# EAGLE design TheLittleEngineers_org-CC3-SpeedBump-V1R1-03-30-1987 (EAGLE 5.10)

## Sheet 1 of 3
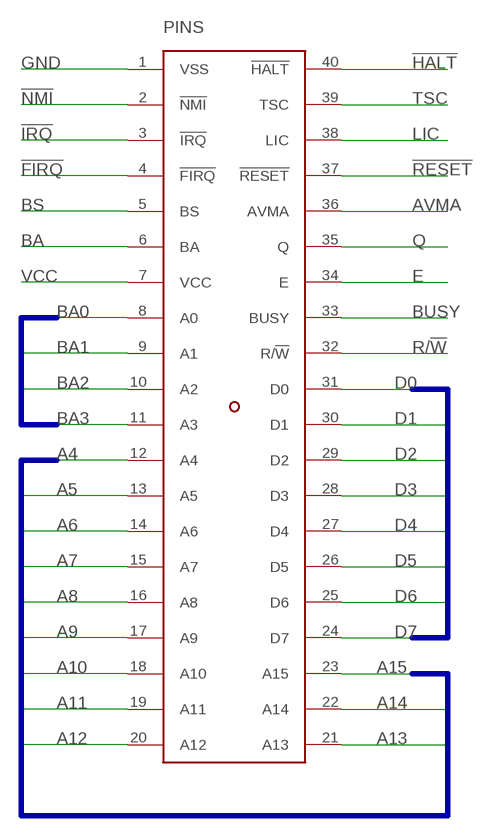
[diagram p0: schematic, sheet 1]

### Parts
PINS  6809E-ISOLATED-VCC-GND-NT-MSPL20  [DIL40-6-MACHINED-SOCKET-PINS-LAYER20OUTLINE]

### Nets
!FIRQ: PINS.4(!FIRQ) ; also sheet 2
!HALT: PINS.40(!HALT) ; also sheet 2
!IRQ: PINS.3(!IRQ) ; also sheet 2
!NMI: PINS.2(!NMI) ; also sheet 2
!RESET: PINS.37(!RESET) ; also sheet 2
A4: PINS.12(A4) ; also sheet 2,3
A5: PINS.13(A5) ; also sheet 2,3
A6: PINS.14(A6) ; also sheet 2,3
A7: PINS.15(A7) ; also sheet 2,3
A8: PINS.16(A8) ; also sheet 2,3
A9: PINS.17(A9) ; also sheet 2,3
A10: PINS.18(A10) ; also sheet 2,3
A11: PINS.19(A11) ; also sheet 2,3
A12: PINS.20(A12) ; also sheet 2,3
A13: PINS.21(A13) ; also sheet 2,3
A14: PINS.22(A14) ; also sheet 2,3
A15: PINS.23(A15) ; also sheet 2,3
AVMA: PINS.36(AVMA) ; also sheet 2
BA: PINS.6(BA) ; also sheet 2
BA0: PINS.8(A0) ; also sheet 3
BA1: PINS.9(A1) ; also sheet 3
BA2: PINS.10(A2) ; also sheet 3
BA3: PINS.11(A3) ; also sheet 3
BS: PINS.5(BS) ; also sheet 2
BUSY: PINS.33(BUSY) ; also sheet 2
D0: PINS.31(D0) ; also sheet 2
D1: PINS.30(D1) ; also sheet 2
D2: PINS.29(D2) ; also sheet 2
D3: PINS.28(D3) ; also sheet 2
D4: PINS.27(D4) ; also sheet 2
D5: PINS.26(D5) ; also sheet 2
D6: PINS.25(D6) ; also sheet 2
D7: PINS.24(D7) ; also sheet 2
E: PINS.34(E) ; also sheet 2
GND [power]: PINS.1(VSS) ; also sheet 2,3
LIC: PINS.38(LIC) ; also sheet 2
Q: PINS.35(Q) ; also sheet 2
R/!W: PINS.32(R/!W) ; also sheet 2
TSC: PINS.39(TSC) ; also sheet 2
VCC [power]: PINS.7(VCC) ; also sheet 2,3

### Buses
A[0..15]
BA[0..3]
D[0..7]

## Sheet 2 of 3
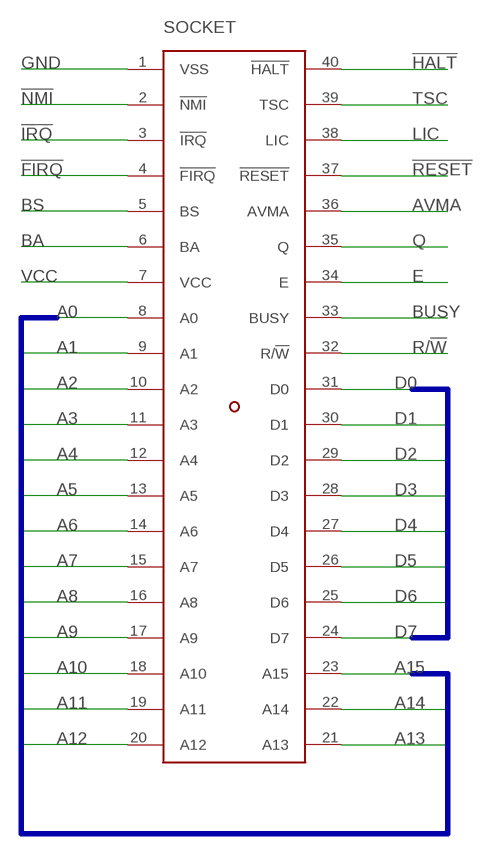
[diagram p1: schematic, sheet 2]

### Parts
SOCKET  6809E-ISOLATED-VCC-GND-NT-RHPS1  [DIL40-6-ROUND-HEADER-PINS-STAGGERED-1]

### Nets
!FIRQ: SOCKET.4(!FIRQ) ; also sheet 1
!HALT: SOCKET.40(!HALT) ; also sheet 1
!IRQ: SOCKET.3(!IRQ) ; also sheet 1
!NMI: SOCKET.2(!NMI) ; also sheet 1
!RESET: SOCKET.37(!RESET) ; also sheet 1
A0: SOCKET.8(A0) ; also sheet 3
A1: SOCKET.9(A1) ; also sheet 3
A2: SOCKET.10(A2) ; also sheet 3
A3: SOCKET.11(A3) ; also sheet 3
A4: SOCKET.12(A4) ; also sheet 1,3
A5: SOCKET.13(A5) ; also sheet 1,3
A6: SOCKET.14(A6) ; also sheet 1,3
A7: SOCKET.15(A7) ; also sheet 1,3
A8: SOCKET.16(A8) ; also sheet 1,3
A9: SOCKET.17(A9) ; also sheet 1,3
A10: SOCKET.18(A10) ; also sheet 1,3
A11: SOCKET.19(A11) ; also sheet 1,3
A12: SOCKET.20(A12) ; also sheet 1,3
A13: SOCKET.21(A13) ; also sheet 1,3
A14: SOCKET.22(A14) ; also sheet 1,3
A15: SOCKET.23(A15) ; also sheet 1,3
AVMA: SOCKET.36(AVMA) ; also sheet 1
BA: SOCKET.6(BA) ; also sheet 1
BS: SOCKET.5(BS) ; also sheet 1
BUSY: SOCKET.33(BUSY) ; also sheet 1
D0: SOCKET.31(D0) ; also sheet 1
D1: SOCKET.30(D1) ; also sheet 1
D2: SOCKET.29(D2) ; also sheet 1
D3: SOCKET.28(D3) ; also sheet 1
D4: SOCKET.27(D4) ; also sheet 1
D5: SOCKET.26(D5) ; also sheet 1
D6: SOCKET.25(D6) ; also sheet 1
D7: SOCKET.24(D7) ; also sheet 1
E: SOCKET.34(E) ; also sheet 1
GND [power]: SOCKET.1(VSS) ; also sheet 1,3
LIC: SOCKET.38(LIC) ; also sheet 1
Q: SOCKET.35(Q) ; also sheet 1
R/!W: SOCKET.32(R/!W) ; also sheet 1
TSC: SOCKET.39(TSC) ; also sheet 1
VCC [power]: SOCKET.7(VCC) ; also sheet 1,3

### Buses
A[0..15]
D[0..7]

## Sheet 3 of 3
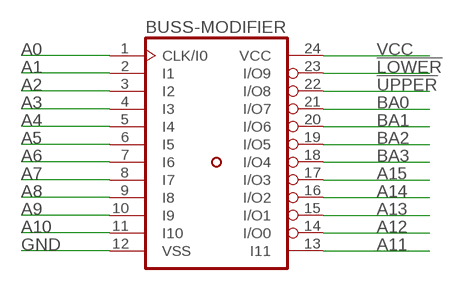
[diagram p2: schematic, sheet 3]

### Parts
BUSS-MODIFIER  GAL22V10N-TMO1S  [DIL24-3-TOP-MINIMAL-OUTLINE-1-STAGGERED]

### Nets
!LOWER: BUSS-MODIFIER.23(I/O9)
!UPPER: BUSS-MODIFIER.22(I/O8)
A0: BUSS-MODIFIER.1(CLK/I0) ; also sheet 2
A1: BUSS-MODIFIER.2(I1) ; also sheet 2
A2: BUSS-MODIFIER.3(I2) ; also sheet 2
A3: BUSS-MODIFIER.4(I3) ; also sheet 2
A4: BUSS-MODIFIER.5(I4) ; also sheet 1,2
A5: BUSS-MODIFIER.6(I5) ; also sheet 1,2
A6: BUSS-MODIFIER.7(I6) ; also sheet 1,2
A7: BUSS-MODIFIER.8(I7) ; also sheet 1,2
A8: BUSS-MODIFIER.9(I8) ; also sheet 1,2
A9: BUSS-MODIFIER.10(I9) ; also sheet 1,2
A10: BUSS-MODIFIER.11(I10) ; also sheet 1,2
A11: BUSS-MODIFIER.13(I11) ; also sheet 1,2
A12: BUSS-MODIFIER.14(I/O0) ; also sheet 1,2
A13: BUSS-MODIFIER.15(I/O1) ; also sheet 1,2
A14: BUSS-MODIFIER.16(I/O2) ; also sheet 1,2
A15: BUSS-MODIFIER.17(I/O3) ; also sheet 1,2
BA0: BUSS-MODIFIER.21(I/O7) ; also sheet 1
BA1: BUSS-MODIFIER.20(I/O6) ; also sheet 1
BA2: BUSS-MODIFIER.19(I/O5) ; also sheet 1
BA3: BUSS-MODIFIER.18(I/O4) ; also sheet 1
GND [power]: BUSS-MODIFIER.12(VSS) ; also sheet 1,2
VCC [power]: BUSS-MODIFIER.24(VCC) ; also sheet 1,2

## Library data of the parts
BUSS-MODIFIER = TheLittleEngineers_org-CC3-SpeedBump-V1R1-03-30-1987:GAL22V10
PINS SOCKET = TheLittleEngineers_org-CC3-SpeedBump-V1R1-03-30-1987:6809E-ISOLATED-VCC-GND

## Net classes
0 default: width 0.203 mm, clearance 0.152 mm
1 power: width 0.762 mm, clearance 0.152 mm

## Board
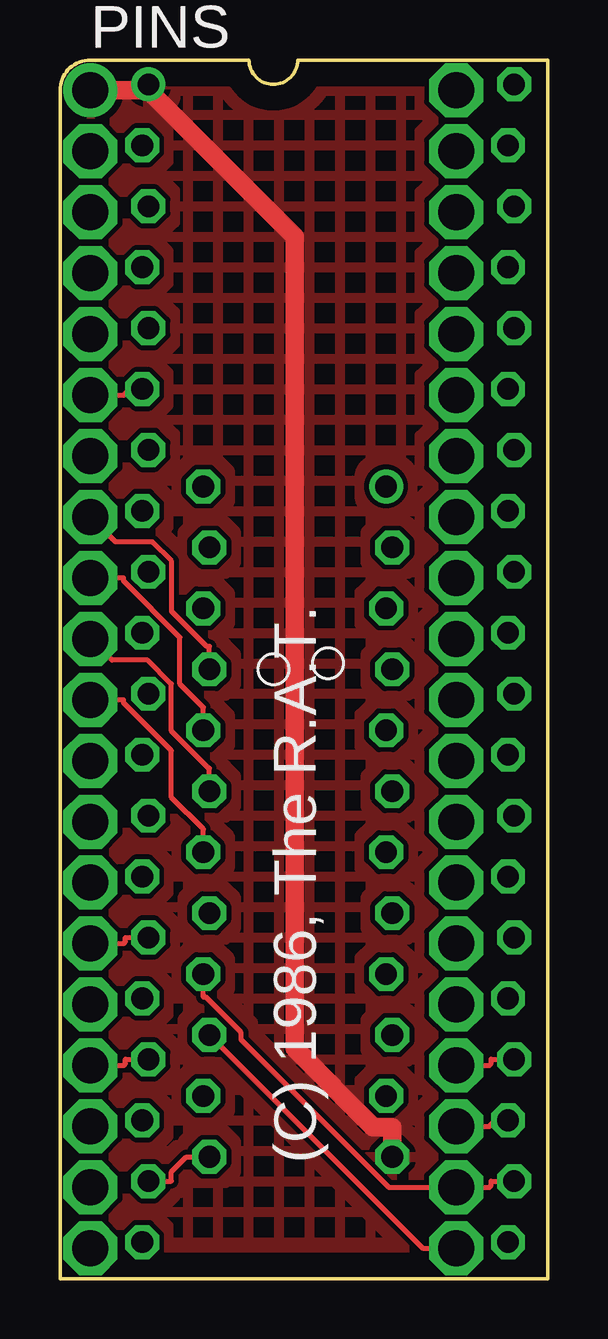
[diagram p3: board, top side]
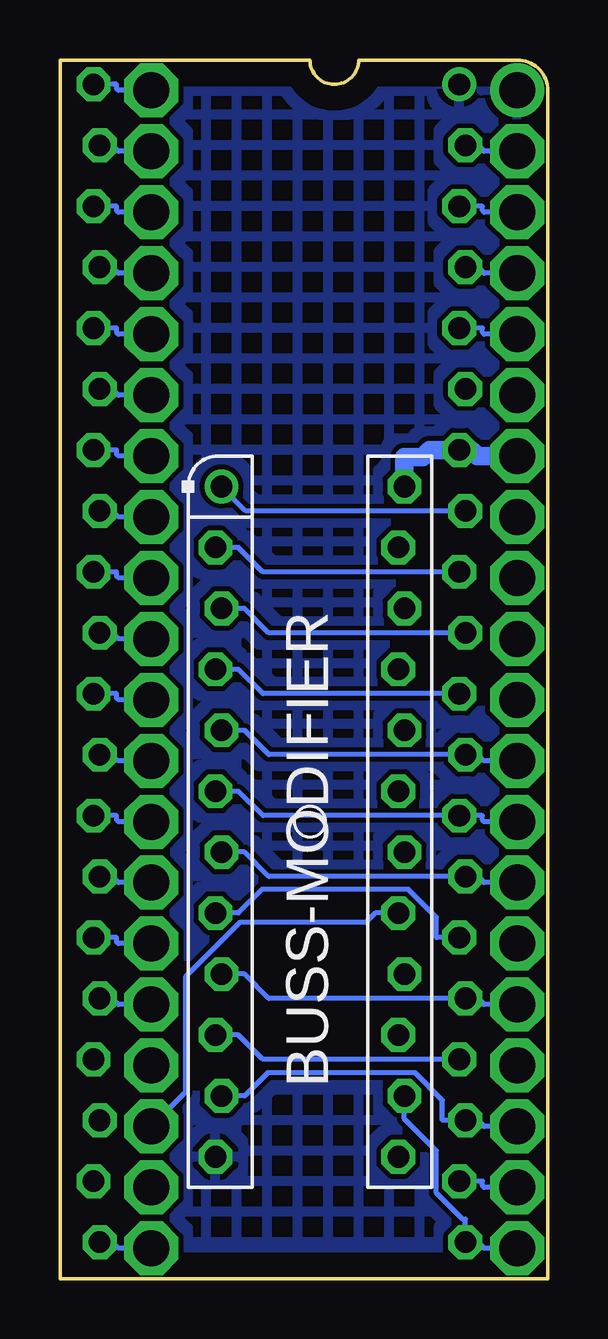
[diagram p4: board, bottom side, seen from below]

Size 20.32 x 50.8 mm. Coordinates in mm from the lower left corner, seen from the top.
Copper layers (1*16): Top 0.035mm / dielectric 1.5mm / Bottom 0.035mm
Design rules "default": minimum track width 10mil, minimum drill 24mil, track to track 8mil, track to pad 8mil, pad to pad 8mil, via to via 8mil, smd to smd 8mil, copper to edge 40mil, drill to drill 8mil, minimum pad ring 10mil, minimum via ring 8mil, stop-mask expansion 4mil, vias tented up to drill 0mil, thermal gap 10mil

### Footprints (pad centres in the part's own frame; a part is rotated, then mirrored left to right if it is on the bottom)
DIL24-3-TOP-MINIMAL-OUTLINE-1-STAGGERED = drill 0.9 round: 1 -13.97,-3.683 | drill 0.9 octagon: 2 -11.43,-3.937; 3 -8.89,-3.683; 4 -6.35,-3.937; 5 -3.81,-3.683; 6 -1.27,-3.937; 7 1.27,-3.683; 8 3.81,-3.937; 9 6.35,-3.683; 10 8.89,-3.937; 11 11.43,-3.683; 12 13.97,-3.937; 13 13.97,3.683; 14 11.43,3.937; 15 8.89,3.683; 16 6.35,3.937; 17 3.81,3.683; 18 1.27,3.937; 19 -1.27,3.683; 20 -3.81,3.937; 21 -6.35,3.683; 22 -8.89,3.937; 23 -11.43,3.683; 24 -13.97,3.937
DIL40-6-MACHINED-SOCKET-PINS-LAYER20OUTLINE = drill 1.5 round: 1 -24.13,-7.62 | drill 1.5 octagon: 2 -21.59,-7.62; 3 -19.05,-7.62; 4 -16.51,-7.62; 5 -13.97,-7.62; 6 -11.43,-7.62; 7 -8.89,-7.62; 8 -6.35,-7.62; 9 -3.81,-7.62; 10 -1.27,-7.62; 11 1.27,-7.62; 12 3.81,-7.62; 13 6.35,-7.62; 14 8.89,-7.62; 15 11.43,-7.62; 16 13.97,-7.62; 17 16.51,-7.62; 18 19.05,-7.62; 19 21.59,-7.62; 20 24.13,-7.62; 21 24.13,7.62; 22 21.59,7.62; 23 19.05,7.62; 24 16.51,7.62; 25 13.97,7.62; 26 11.43,7.62; 27 8.89,7.62; 28 6.35,7.62; 29 3.81,7.62; 30 1.27,7.62; 31 -1.27,7.62; 32 -3.81,7.62; 33 -6.35,7.62; 34 -8.89,7.62; 35 -11.43,7.62; 36 -13.97,7.62; 37 -16.51,7.62; 38 -19.05,7.62; 39 -21.59,7.62; 40 -24.13,7.62
DIL40-6-ROUND-HEADER-PINS-STAGGERED-1 = drill 0.9 round: 1 -24.13,-7.493 | drill 0.9 octagon: 2 -21.59,-7.747; 3 -19.05,-7.493; 4 -16.51,-7.747; 5 -13.97,-7.493; 6 -11.43,-7.747; 7 -8.89,-7.493; 8 -6.35,-7.747; 9 -3.81,-7.493; 10 -1.27,-7.747; 11 1.27,-7.493; 12 3.81,-7.747; 13 6.35,-7.493; 14 8.89,-7.747; 15 11.43,-7.493; 16 13.97,-7.747; 17 16.51,-7.493; 18 19.05,-7.747; 19 21.59,-7.493; 20 24.13,-7.747; 21 24.13,7.493; 22 21.59,7.747; 23 19.05,7.493; 24 16.51,7.747; 25 13.97,7.493; 26 11.43,7.747; 27 8.89,7.493; 28 6.35,7.747; 29 3.81,7.493; 30 1.27,7.747; 31 -1.27,7.493; 32 -3.81,7.747; 33 -6.35,7.493; 34 -8.89,7.747; 35 -11.43,7.493; 36 -13.97,7.747; 37 -16.51,7.493; 38 -19.05,7.747; 39 -21.59,7.493; 40 -24.13,7.747

### Placement (x,y rotation side)
BUSS-MODIFIER  9.91,19.05 270 bottom
PINS  8.89,25.4 270 top
SOCKET  11.18,25.65 270 top

### Tracks (layer width: path | path; a pad name or v marks a point on that pad's centre or on a via)
!FIRQ
  Bottom 0.203: PINS.4 2.65,41.91 2.9,42.16 SOCKET.4
!HALT
  Bottom 0.203: SOCKET.40 17.97,49.78 17.97,49.61 17.89,49.53 PINS.40
!IRQ
  Bottom 0.203: SOCKET.3 2.73,44.7 2.73,44.53 2.65,44.45 PINS.3
!NMI
  Bottom 0.203: PINS.2 2.65,46.99 2.9,47.24 SOCKET.2
!RESET
  Bottom 0.203: PINS.37 17.89,41.91 18.14,42.16 SOCKET.37
A0
  Bottom 0.203: SOCKET.8 12.57,32 BUSS-MODIFIER.1
A1
  Bottom 0.203: BUSS-MODIFIER.2 12.88,30.48 11.87,29.46 SOCKET.9
A2
  Bottom 0.203: BUSS-MODIFIER.3 12.63,27.94 11.62,26.92 SOCKET.10
A3
  Bottom 0.203: BUSS-MODIFIER.4 12.88,25.4 11.87,24.38 SOCKET.11
A4
  Bottom 0.203: BUSS-MODIFIER.5 12.63,22.86 11.62,21.84 SOCKET.12 2.9,21.84 2.65,21.59 PINS.12
A5
  Bottom 0.203: PINS.13 2.65,19.05 2.73,19.13 2.73,19.3 SOCKET.13 11.87,19.3 12.88,20.32 BUSS-MODIFIER.6
A6
  Bottom 0.203: BUSS-MODIFIER.7 12.63,17.78 11.62,16.76 SOCKET.14 2.9,16.76 2.65,16.51 PINS.14
A7
  Top 0.203: SOCKET.15 2.73,14.22 2.73,14.05 2.65,13.97 PINS.15
  Bottom 0.203: BUSS-MODIFIER.8 12.88,15.24 11.9,16.23 5.81,16.23 4.64,15.06 4.64,14.22 SOCKET.15
A8
  Bottom 0.203: BUSS-MODIFIER.9 12.63,12.7 11.62,11.68 SOCKET.16 2.9,11.68 2.65,11.43 PINS.16
A9
  Top 0.203: SOCKET.17 2.73,9.14 2.73,8.97 2.65,8.89 PINS.17
  Bottom 0.203: BUSS-MODIFIER.10 12.88,10.16 11.87,9.14 SOCKET.17
A10
  Bottom 0.203: BUSS-MODIFIER.11 12.63,7.62 11.67,8.58 5.53,8.58 4.39,7.44 4.39,6.6 SOCKET.18 2.9,6.6 2.65,6.35 PINS.18
A11
  Top 0.203: SOCKET.19 4.64,4.06 4.64,4.46 5.26,5.08 BUSS-MODIFIER.13
  Bottom 0.203: SOCKET.19 2.73,4.06 2.73,3.89 2.65,3.81 PINS.19
A12
  Bottom 0.203: BUSS-MODIFIER.14 5.97,6.66 4.64,5.33 4.64,3.57 3.55,2.48 3.43,2.48 SOCKET.20 2.9,1.52 2.65,1.27 PINS.20
A13
  Top 0.203: PINS.21 15.11,1.27 BUSS-MODIFIER.15
  Bottom 0.203: PINS.21 17.89,1.27 18.14,1.52 SOCKET.21
A14
  Top 0.203: SOCKET.22 17.97,4.06 17.97,3.89 17.89,3.81 PINS.22 13.7,3.81 7.55,9.96 7.55,10.26 6.07,11.74 5.97,11.74 BUSS-MODIFIER.16
A15
  Top 0.203: PINS.23 17.89,6.35 18.14,6.6 SOCKET.23
  Bottom 0.203: BUSS-MODIFIER.17 7.18,15.24 7.58,14.84 12.83,14.84 15.1,12.58 15.1,7.76 PINS.23
AVMA
  Bottom 0.203: SOCKET.36 17.97,39.62 17.97,39.45 17.89,39.37 PINS.36
BA
  Top 0.203: PINS.6 2.65,36.83 2.9,37.08 SOCKET.6
BA0
  Top 0.203: BUSS-MODIFIER.21 6.22,26.36 6.11,26.36 4.65,27.82 4.65,29.91 3.85,30.71 2.31,30.71 PINS.8
BA1
  Top 0.203: BUSS-MODIFIER.20 5.97,23.82 5,24.79 5,26.74 2.65,29.08 2.65,29.21 PINS.9
BA2
  Top 0.203: BUSS-MODIFIER.19 6.22,21.28 6.2,21.28 4.64,22.83 4.64,24.8 3.66,25.78 2.16,25.78 PINS.10
BA3
  Top 0.203: BUSS-MODIFIER.18 5.97,18.74 4.64,20.07 4.64,22.01 2.65,24 2.65,24.13 PINS.11
BS
  Bottom 0.203: SOCKET.5 2.73,39.62 2.73,39.45 2.65,39.37 PINS.5
BUSY
  Bottom 0.203: PINS.33 17.89,31.75 18.14,32 SOCKET.33
D0
  Bottom 0.203: PINS.31 17.89,26.67 18.14,26.92 SOCKET.31
D1
  Bottom 0.203: SOCKET.30 17.97,24.38 17.97,24.21 17.89,24.13 PINS.30
D2
  Bottom 0.203: PINS.29 17.89,21.59 18.14,21.84 SOCKET.29
D3
  Bottom 0.203: SOCKET.28 17.97,19.3 17.97,19.13 17.89,19.05 PINS.28
D4
  Bottom 0.203: PINS.27 17.89,16.51 18.14,16.76 SOCKET.27
D5
  Bottom 0.203: SOCKET.26 17.97,14.22 17.97,14.05 17.89,13.97 PINS.26
D6
  Bottom 0.203: PINS.25 17.89,11.43 18.14,11.68 SOCKET.25
D7
  Top 0.203: SOCKET.24 17.97,9.14 17.97,8.97 17.89,8.89 PINS.24
E
  Bottom 0.203: SOCKET.34 17.97,34.54 17.97,34.37 17.89,34.29 PINS.34
GND
  Top 0.762: 3.68,49.53 9.78,43.43 9.78,9.6 13.06,6.32 13.84,6.32 BUSS-MODIFIER.12 | 3.68,49.53 SOCKET.1 | 3.68,49.53 PINS.1
  pour Bottom (hatched): -0.51,51.56 20.83,51.56 20.83,-0.76 -0.51,-0.76
  pour Top (hatched): -0.76,51.82 21.08,51.82 21.08,-0.76 -0.76,-0.76
LIC
  Bottom 0.203: SOCKET.38 17.97,44.7 17.97,44.53 17.89,44.45 PINS.38
Q
  Bottom 0.203: PINS.35 17.89,36.83 18.14,37.08 SOCKET.35
R/!W
  Bottom 0.203: SOCKET.32 17.97,29.46 17.97,29.29 17.89,29.21 PINS.32
TSC
  Bottom 0.203: PINS.39 17.89,46.99 18.14,47.24 SOCKET.39
VCC
  Bottom 0.762: BUSS-MODIFIER.24 5.97,34.26 5.21,34.26 4.92,34.54 SOCKET.7 3.18,34.54 2.93,34.29 PINS.7

### Text on the board
tPlace: (C) 1986, The R.A.T.
Reference: The 22V10 mounts on the solder side. | Use a low profile IC Socket. | The large holes are for socket pins | liberated from machined pin I.C. sockets. | Use the LONGEST you can find. | These become the pins that plug | into the CPU Socket. The small | holes are for the new CPU Socket.